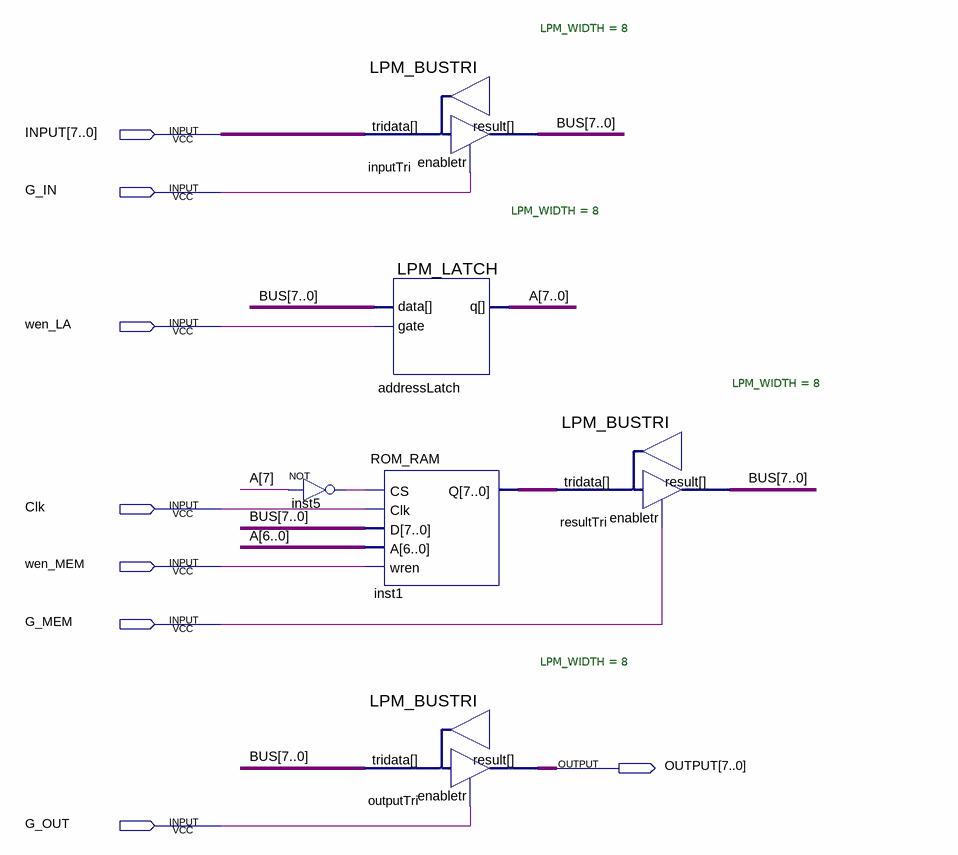
[diagram p0: schematic sheet]
// Quartus schematic MEM.bdf as structural Verilog: 6 symbols, 8 pins
module MEM (
  input  [7:0] INPUT,
  input  G_IN,
  input  wen_LA,
  input  Clk,
  input  wen_MEM,
  input  G_MEM,
  input  G_OUT,
  output [7:0] OUTPUT
);

  wire inst5_out;
  wire [7:0] A, BUS, inst1_q;

  not inst5 (inst5_out, A[7]);
  LPM_BUSTRI #(.LPM_WIDTH(8)) inputTri (.enabletr(G_IN), .result(BUS), .tridata(INPUT));
  LPM_LATCH #(.LPM_WIDTH(8)) addressLatch (.data(BUS), .gate(wen_LA), .q(A));
  ROM_RAM inst1 (.CS(inst5_out), .Clk(Clk), .D(BUS), .A(A[6:0]), .wren(wen_MEM), .Q(inst1_q));
  LPM_BUSTRI #(.LPM_WIDTH(8)) outputTri (.enabletr(G_OUT), .result(OUTPUT), .tridata(BUS));
  LPM_BUSTRI #(.LPM_WIDTH(8)) resultTri (.enabletr(G_MEM), .result(BUS), .tridata(inst1_q));
endmodule
